# Altium schematic sheet RF.SchDoc
size A4
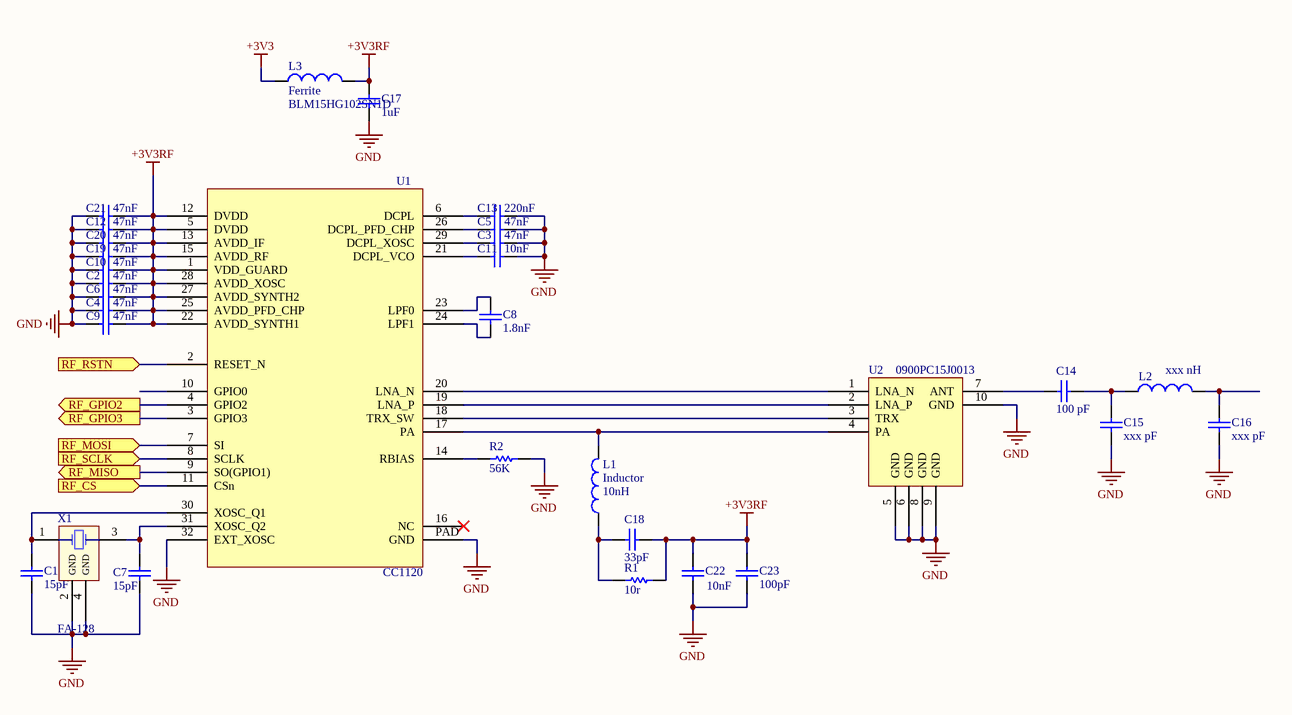
[diagram p0: RF.SchDoc]

## Parts
C1  value 15pF  [0402_ipc]  (hidden comment: Cap)
C2  value 47nF  [0402_ipc]  (hidden comment: Cap)
C3  value 47nF  [0402_ipc]  (hidden comment: Cap)
C4  value 47nF  [0402_ipc]  (hidden comment: Cap)
C5  value 47nF  [0402_ipc]  (hidden comment: Cap)
C6  value 47nF  [0402_ipc]  (hidden comment: Cap)
C7  value 15pF  [0402_ipc]  (hidden comment: Cap)
C8  value 1.8nF  [0402_ipc]  (hidden comment: Cap)
C9  value 47nF  [0402_ipc]  (hidden comment: Cap)
C10  value 47nF  [0402_ipc]  (hidden comment: Cap)
C11  value 10nF  [0402_ipc]  (hidden comment: Cap)
C12  value 47nF  [0402_ipc]  (hidden comment: Cap)
C13  value 220nF  [0402_ipc]  (hidden comment: Cap)
C14  value 100 pF  [0402_ipc]  (hidden comment: Cap)
C15  value xxx pF  [0402_ipc]  (hidden comment: Cap)
C16  value xxx pF  [0402_ipc]  (hidden comment: Cap)
C17  value 1uF  [0402_ipc]  (hidden comment: Cap)
C18  value 33pF  [0402_ipc]  (hidden comment: Cap)
C19  value 47nF  [0402_ipc]  (hidden comment: Cap)
C20  value 47nF  [0402_ipc]  (hidden comment: Cap)
C21  value 47nF  [0402_ipc]  (hidden comment: Cap)
C22  value 10nF  [0402_ipc]  (hidden comment: Cap)
C23  value 100pF  [0402_ipc]  (hidden comment: Cap)
L1  Inductor  value 10nH  [0402_ipc]
L2  value xxx nH  [0402_ipc]  (hidden comment: Inductor)
L3  Ferrite  value BLM15HG102SN1D  [0402_ipc]
R1  value 10r  [0402_ipc]  (hidden comment: Res)
R2  value 56K  [0402_ipc]  (hidden comment: Res)
U1  CC1120  [CC1120_VQFN32]
U2  0900PC15J0013  [0900PC15J0013]
X1  FA-128  [FA-128]

## Ports
RF_CS (in), RF_GPIO2 (out), RF_GPIO3 (out), RF_MISO (out), RF_MOSI (in), RF_RSTN (in), RF_SCLK (in)

## Nets
+3V3: L3.1
+3V3RF: C2.1 C4.1 C6.1 C9.1 C10.1 C12.1 C17.2 C18.1 C19.1 C20.1 C21.1 C22.2 C23.2 L3.2 R1.2 U1.1(VDD_GUARD) U1.5(DVDD) U1.12(DVDD) U1.13(AVDD_IF) U1.15(AVDD_RF) U1.22(AVDD_SYNTH1) U1.25(AVDD_PFD_CHP) U1.27(AVDD_SYNTH2) U1.28(AVDD_XOSC)
GND: C1.1 C2.2 C3.1 C4.2 C5.1 C6.2 C7.1 C9.2 C10.2 C11.1 C12.2 C13.1 C15.1 C16.1 C17.1 C19.2 C20.2 C21.2 C22.1 C23.1 R2.1 U1.32(EXT_XOSC) U1.PAD(GND) U2.5(GND) U2.6(GND) U2.8(GND) U2.9(GND) U2.10(GND) X1.2(GND) X1.4(GND)
RF_CS: U1.11(CSn) ; port RF_CS
RF_GPIO2: U1.4(GPIO2) ; port RF_GPIO2
RF_GPIO3: U1.3(GPIO3) ; port RF_GPIO3
RF_MISO: U1.9(SO(GPIO1)) ; port RF_MISO
RF_MOSI: U1.7(SI) ; port RF_MOSI
RF_RSTN: U1.2(RESET_N) ; port RF_RSTN
RF_SCLK: U1.8(SCLK) ; port RF_SCLK
NetC1_2: C1.2 U1.30(XOSC_Q1) X1.1(OSC1)
NetC3_2: C3.2 U1.29(DCPL_XOSC)
NetC5_2: C5.2 U1.26(DCPL_PFD_CHP)
NetC7_2: C7.2 U1.31(XOSC_Q2) X1.3(OSC2)
NetC8_1: C8.1 U1.24(LPF1)
NetC8_2: C8.2 U1.23(LPF0)
NetC11_2: C11.2 U1.21(DCPL_VCO)
NetC13_2: C13.2 U1.6(DCPL)
NetC14_1: C14.1 C15.2 L2.1
NetC14_2: C14.2 U2.7(ANT)
NetC16_2: C16.2 L2.2
NetC18_2: C18.2 L1.1 R1.1
NetL1_2: L1.2 U1.17(PA) U2.4(PA)
NetR2_2: R2.2 U1.14(RBIAS)
NetU1_18: U1.18(TRX_SW) U2.3(TRX)
NetU1_19: U1.19(LNA_P) U2.2(LNA_P)
NetU1_20: U1.20(LNA_N) U2.1(LNA_N)

Not connected (* = marked no-connect by the designer): U1 10(GPIO0) 16(NC)*

## Library data of the parts
C1-C23 = Cap: Capacitor; PackageReference: RAD-0.3; Publisher: Altium Limited
L3 = Inductor: PackageReference: 0402-A; PackageDescription: Chip Inductor
R1 R2 = Res: Resistor; PackageReference: AXIAL-0.3; PackageDescription: Axial Device, Thru-Hole; 2 Leads; 0.3 in Pin Spacing
X1 = FA-128: Quartz 32 MHz
L1 L2 = Inductor: PackageReference: 0402-A; PackageDescription: Chip Inductor